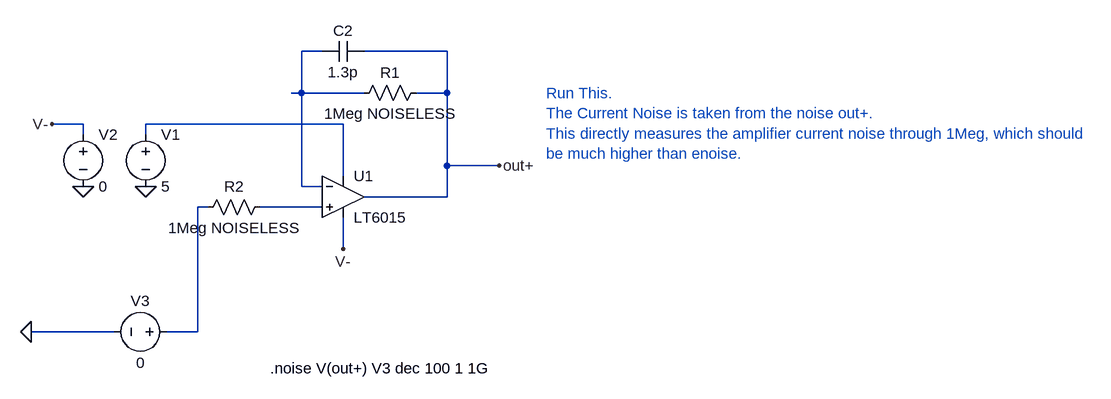
[diagram p0: schematic LT6015_inoise.asc]
LT6015_inoise.asc, the LTspice schematic file:
Version 4
SHEET 1 1284 680
WIRE 48 32 16 32
WIRE 240 32 112 32
WIRE 16 96 16 32
WIRE 16 96 0 96
WIRE 112 96 16 96
WIRE 240 96 240 32
WIRE 240 96 192 96
WIRE -320 144 -368 144
WIRE 80 144 -224 144
WIRE -320 160 -320 144
WIRE -224 160 -224 144
WIRE 240 208 240 96
WIRE 320 208 240 208
WIRE 80 224 80 144
WIRE 16 240 16 96
WIRE 48 240 16 240
WIRE 240 256 240 208
WIRE 240 256 112 256
WIRE -128 272 -144 272
WIRE 48 272 -48 272
WIRE 80 336 80 288
WIRE -272 464 -400 464
WIRE -144 464 -144 272
WIRE -144 464 -192 464
FLAG -224 240 0
FLAG 320 208 out+
FLAG -320 240 0
FLAG -368 144 V-
FLAG 80 336 V-
FLAG -400 464 0
SYMBOL voltage -224 144 R0
WINDOW 123 0 0 Left 0
WINDOW 39 0 0 Left 0
SYMATTR InstName V1
SYMATTR Value 5
SYMBOL res 208 80 R90
WINDOW 0 0 56 VBottom 2
WINDOW 3 32 56 VTop 2
SYMATTR InstName R1
SYMATTR Value 1Meg NOISELESS
SYMBOL cap 112 16 R90
WINDOW 0 0 32 VBottom 2
WINDOW 3 32 32 VTop 2
SYMATTR InstName C2
SYMATTR Value 1.3p
SYMBOL voltage -320 144 R0
WINDOW 123 0 0 Left 0
WINDOW 39 0 0 Left 0
SYMATTR InstName V2
SYMATTR Value 0
SYMBOL voltage -176 464 R90
WINDOW 0 -32 56 VBottom 2
WINDOW 3 32 56 VTop 2
WINDOW 123 0 0 Left 0
WINDOW 39 0 0 Left 0
SYMATTR InstName V3
SYMATTR Value 0
SYMBOL Opamps\\LT6015 80 256 R0
SYMATTR InstName U1
SYMBOL res -32 256 R90
WINDOW 0 0 56 VBottom 2
WINDOW 3 32 56 VTop 2
SYMATTR InstName R2
SYMATTR Value 1Meg NOISELESS
TEXT 392 96 Left 2 ;Run This.\nThe Current Noise is taken from the noise out+.\nThis directly measures the amplifier current noise through 1Meg, which should\nbe much higher than enoise.
TEXT -32 520 Left 2 !.noise V(out+) V3 dec 100 1 1G

The netlist it stands for:
* LT6015_inoise.asc
V1 N002 0 5
R1 out+ N001 1Meg NOISELESS
C2 out+ N001 1.3p
V2 V- 0 0
V3 N003 0 0
XU1 N004 N001 N002 V- out+ LT6016  ; LT6015, pins In+ In- V+ V- OUT
R2 N004 N003 1Meg NOISELESS
* Run This.
* The Current Noise is taken from the noise out+.
* This directly measures the amplifier current noise through 1Meg, which should
* be much higher than enoise.
.noise V(out+) V3 dec 100 1 1G
.lib LTC2.lib
.backanno
.end